# EAGLE schematic gal-psg (EAGLE 6.3)
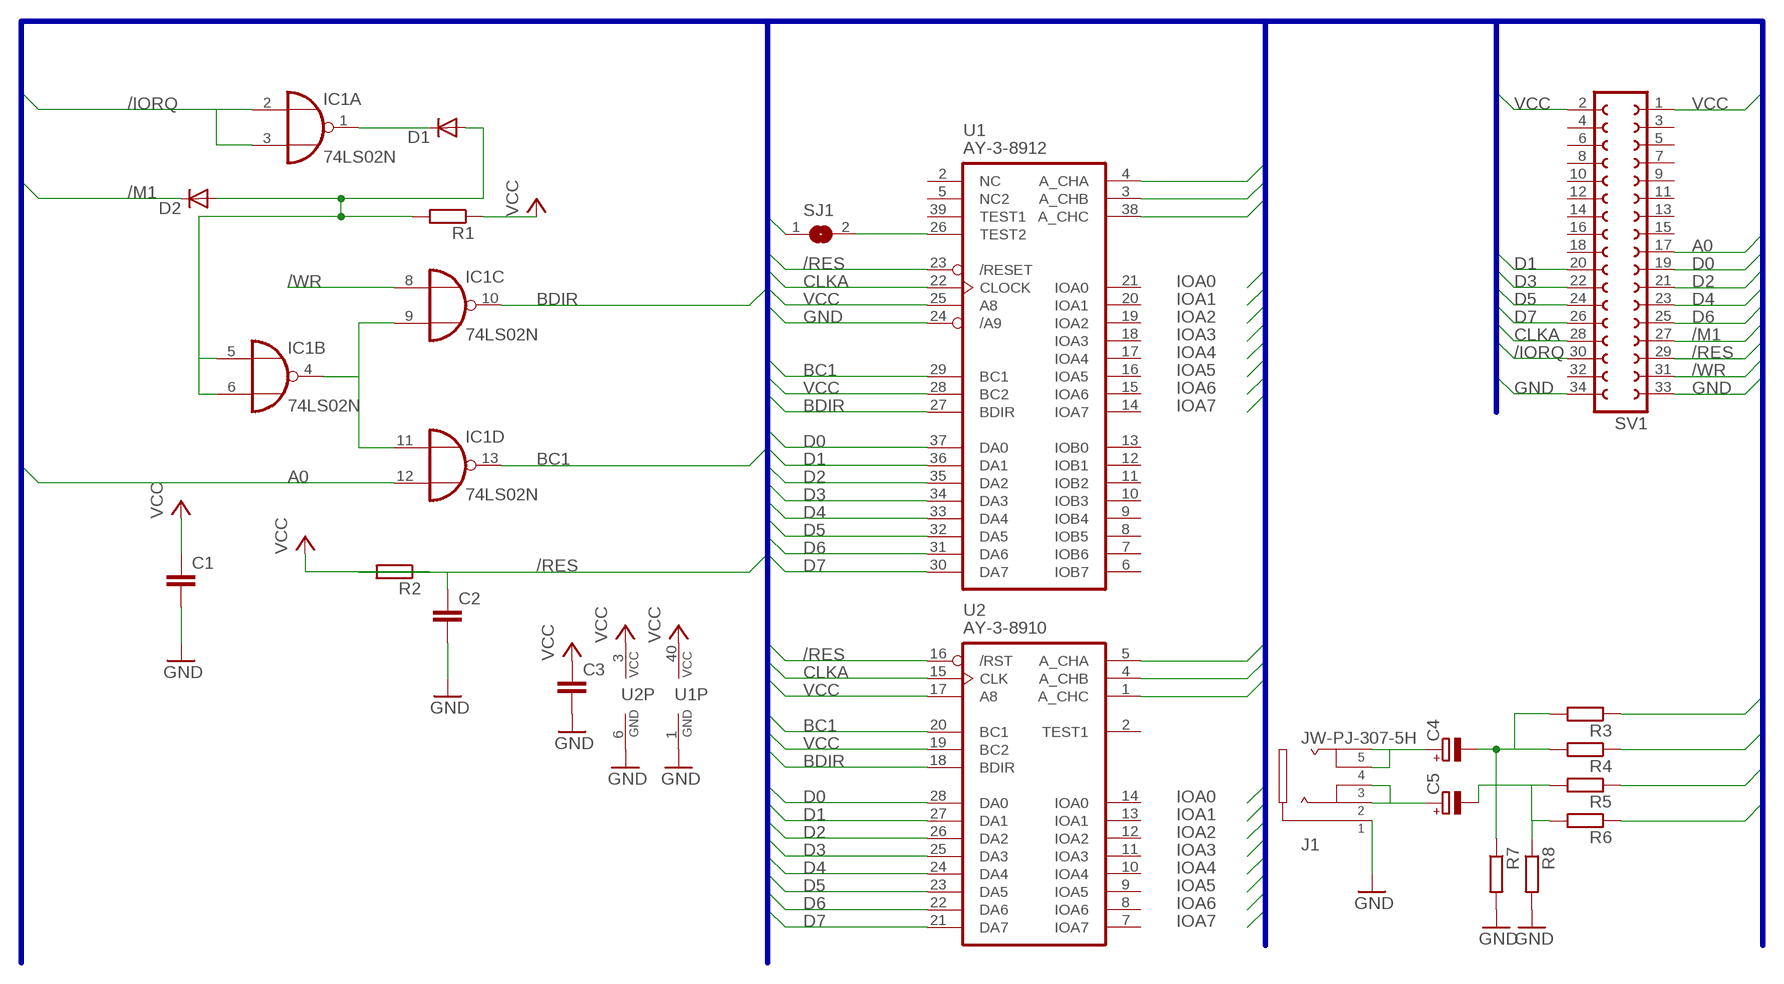
[diagram p0: schematic, sheet 1]

## Parts
C1  C-EU025-024X044  [C025-024X044]
C2  C-EU025-024X044  [C025-024X044]
C3  C-EU025-024X044  [C025-024X044]
C4  CPOL-EUE1.8-4  [E1,8-4]
C5  CPOL-EUE1.8-4  [E1,8-4]
D1  DIODE-D-2.5  [D-2.5]
D2  DIODE-D-2.5  [D-2.5]
IC1  74LS02N  [DIL14]
J1  JW-PJ-307-5H  [JW-PJ-307-5H]
R1  R-EU_0207/2V  [0207/2V]
R2  R-EU_0207/2V  [0207/2V]
R3  R-EU_0207/2V  [0207/2V]
R4  R-EU_0207/2V  [0207/2V]
R5  R-EU_0207/2V  [0207/2V]
R6  R-EU_0207/2V  [0207/2V]
R7  R-EU_0207/2V  [0207/2V]
R8  R-EU_0207/2V  [0207/2V]
SJ1  SJ  [SJ]
SV1  FE17-2W  [FE17-2W]
U1  AY-3-8912  [DIL40]
U2  AY-3-8910  [DIL28-6]

## Nets
/IORQ: IC1.2(A:I0) IC1.3(A:I1) SV1.30
/M1: D2.C SV1.27
/RES: C2.1 R2.2 SV1.29 U1.23(/RESET) U2.16(/RST)
/WR: IC1.8(C:I0) SV1.31
A: R3.1 U1.4(A_CHA) U2.5(A_CHA)
A0: IC1.12(D:I1) SV1.17
B: R4.1 R5.1 U1.3(A_CHB) U2.4(A_CHB)
BC1: IC1.13(D:O) U1.29(BC1) U2.20(BC1)
BDIR: IC1.10(C:O) U1.27(BDIR) U2.18(BDIR)
C: R6.1 U1.38(A_CHC) U2.1(A_CHC)
CLKA: SV1.28 U1.22(CLOCK) U2.15(CLK)
D0: SV1.19 U1.37(DA0) U2.28(DA0)
D1: SV1.20 U1.36(DA1) U2.27(DA1)
D2: SV1.21 U1.35(DA2) U2.26(DA2)
D3: SV1.22 U1.34(DA3) U2.25(DA3)
D4: SV1.23 U1.33(DA4) U2.24(DA4)
D5: SV1.24 U1.32(DA5) U2.23(DA5)
D6: SV1.25 U1.31(DA6) U2.22(DA6)
D7: SV1.26 U1.30(DA7) U2.21(DA7)
GND: C1.2 C2.2 C3.2 J1.1 R7.2 R8.2 SJ1.1 SV1.33 SV1.34 U1.1(GND) U1.24(/A9) U2.6(GND)
N$1: SJ1.2 U1.26(TEST2)
N$2: D1.C IC1.1(A:O)
N$4: C5.+ J1.2 J1.3
N$5: D1.A D2.A IC1.5(B:I0) IC1.6(B:I1) R1.2
N$6: C4.- R3.2 R4.2 R7.1
N$7: IC1.4(B:O) IC1.9(C:I1) IC1.11(D:I0)
N$8: C4.+ J1.4 J1.5
N$9: C5.- R5.2 R6.2 R8.1
VCC: C1.1 C3.1 R1.1 R2.1 SV1.1 SV1.2 U1.25(A8) U1.28(BC2) U1.40(VCC) U2.3(VCC) U2.17(A8) U2.19(BC2)
Unconnected: SV1.3 SV1.4 SV1.5 SV1.6 SV1.7 SV1.8 SV1.9 SV1.10 SV1.11 SV1.12 SV1.13 SV1.14 SV1.15 SV1.16 SV1.18 SV1.32 U1.2(NC) U1.5(NC2) U1.6(IOB7) U1.7(IOB6) U1.8(IOB5) U1.9(IOB4) U1.10(IOB3) U1.11(IOB2) U1.12(IOB1) U1.13(IOB0) U1.14(IOA7) U1.15(IOA6) U1.16(IOA5) U1.17(IOA4) U1.18(IOA3) U1.19(IOA2) U1.20(IOA1) U1.21(IOA0) U1.39(TEST1) U2.2(TEST1) U2.7(IOA7) U2.8(IOA6) U2.9(IOA5) U2.10(IOA4) U2.11(IOA3) U2.12(IOA2) U2.13(IOA1) U2.14(IOA0)

## Buses
D[0..7],BDIR,BC1,/RES,CLKA,IOA[0..7],VCC,GND,A,B,C,/IORQ,/M1,/WR,A0,A,B,C

## Power pins joined to a net without a drawn wire
GND: IC1.7(P:GND)
VCC: IC1.14(P:VCC)

## Library data of the parts
C1-C3 = rcl:C-EU: CAPACITOR, European symbol
C4 C5 = rcl:CPOL-EU: POLARIZED CAPACITOR, European symbol
D1 D2 = diode:DIODE-: DIODE
IC1 = 74xx-eu:74*02: Quad 2-input NOR gate
J1 = audiojacks:JW-PJ-307-5
R1-R8 = rcl:R-EU_: RESISTOR, European symbol
SJ1 = jumper:SJ: SMD solder JUMPER
SV1 = con-lsta:FE17-2W: FEMALE HEADER; OC_FARNELL: unknown; OC_NEWARK: unknown
U1 = oldchips:AY-3-8912: Programmable sound generator
U2 = oldchips:AY-3-8910: Programmable sound generator